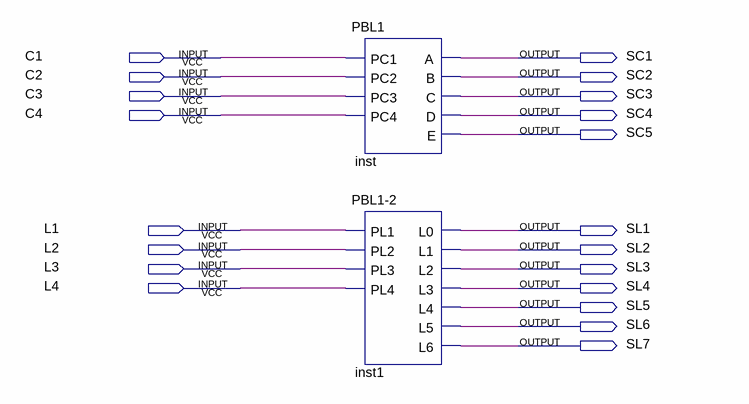
[diagram p0: schematic sheet]
// Quartus schematic CircuitoDigital.bdf as structural Verilog: 2 symbols, 20 pins
module CircuitoDigital (
  input  C1,
  input  C2,
  input  C3,
  input  C4,
  input  L1,
  input  L2,
  input  L3,
  input  L4,
  output SC1,
  output SC2,
  output SC3,
  output SC4,
  output SC5,
  output SL1,
  output SL2,
  output SL3,
  output SL4,
  output SL5,
  output SL6,
  output SL7
);

  PBL1 inst (.PC1(C1), .PC2(C2), .PC3(C3), .PC4(C4), .A(SC1), .B(SC2), .C(SC3), .D(SC4), .E(SC5));
  \PBL1-2  inst1 (
    .PL1(L1), .PL2(L2), .PL3(L3), .PL4(L4), .L0(SL1), .L1(SL2), .L2(SL3), .L3(SL4), .L4(SL5), .L5(SL6),
    .L6(SL7));
endmodule
